# Altium schematic sheet IQDownconverterWaveyRadar.SchDoc: IQ Downconverter WaveyRadar Schematic
size Letter; Author: Will Vu; CompanyName: Raccoon Wireless; DrawnBy: Will Vu, Raccoon Wireless; Engineer: Will Vu; Organization: Raccoon Wireless; DocumentNumber: 2-10; Revision: 2; SheetNumber: 10; SheetTotal: 15
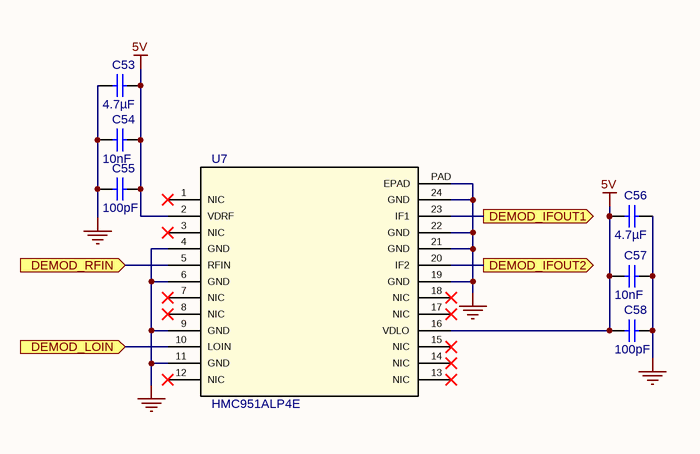
[diagram p0: IQDownconverterWaveyRadar.SchDoc]

## Parts
C53  value 4.7µF  [CAPC0603(1608)100_L]  (hidden comment: Capacitor 4.7µF +/-20% 10V 0603)
C54  value 10nF  [CAPC0402(1005)60_L]  (hidden comment: Capacitor 10nF +/-20% 50V 0402)
C55  value 100pF  [CAPC1005X56X25LL10T15]  (hidden comment: 04023A101JAT2A)
C56  value 4.7µF  [CAPC0603(1608)100_L]  (hidden comment: Capacitor 4.7µF +/-20% 10V 0603)
C57  value 10nF  [CAPC0402(1005)60_L]  (hidden comment: Capacitor 10nF +/-20% 50V 0402)
C58  value 100pF  [CAPC1005X56X25LL10T15]  (hidden comment: 04023A101JAT2A)
U7  HMC951ALP4E  [HCP_24_3]

## Ports
DEMOD_IFOUT1 (out), DEMOD_IFOUT2 (out), DEMOD_LOIN (in), DEMOD_RFIN (in)

## Nets
5V: C53.2 C54.2 C55.2 C56.1 C57.1 C58.1 U7.2(VDRF) U7.16(VDLO)
GND: C53.1 C54.1 C55.1 C56.2 C57.2 C58.2 U7.4(GND) U7.6(GND) U7.9(GND) U7.11(GND) U7.19(GND) U7.21(GND) U7.22(GND) U7.24(GND) U7.PAD(EPAD)
DEMOD_IFOUT1: U7.23(IF1) ; port DEMOD_IFOUT1
DEMOD_IFOUT2: U7.20(IF2) ; port DEMOD_IFOUT2
DEMOD_LOIN: U7.10(LOIN) ; port DEMOD_LOIN
DEMOD_RFIN: U7.5(RFIN) ; port DEMOD_RFIN

Not connected (* = marked no-connect by the designer): U7 1(NIC)* 3(NIC)* 7(NIC)* 8(NIC)* 12(NIC)* 13(NIC)* 14(NIC)* 15(NIC)* 17(NIC)* 18(NIC)*

## Notes on the sheet
- /

## Library data of the parts
C53 C56 = CMP-001-00076-5: Chip Capacitor, 4.7µF +/-20%, 10V, 0603, Thickness 1 mm; Tolerance: 10%; Mounting Technology: SMT; Pins: 2; Max Operating Temperature: 85°C; Case/Package: 0603; Voltage Rating: 10V; Min Operating Temperature: -55°C
C54 C57 = CMP-001-00069-4: Chip Capacitor, 10nF +/-20%, 50V, 0402, Thickness 0.6 mm; Tolerance: 5%; Max Operating Temperature: 85°C; Voltage Rating: 50V; Case/Package: 0402; Pins: 2; Min Operating Temperature: -55°C; Mounting Technology: SMT
C55 C58 = CMP-001-00083-2: AVX - 04023A101JAT2A - SMD Multilayer Ceramic Capacitor, 100 pF, 25 V, 0402 [1005 Metric], ± 5%, C0G / NP0, AVX 0402 MLCC
U7 = CMP-021-000000-5: 5.6  GHz to 8.6 GHz, GaAs, MMIC, I/Q Downconverter; RefDes: RefDes; Copyright: Copyright (C) 2018 Accelerated Designs. All rights reserved; Type: DEV; Design Item ID: HMC951ALP4E; Source: 2021-05-31_20-45-29.SchLib